# EAGLE design ESP32CAM-Enclosure (EAGLE 9.4.2)
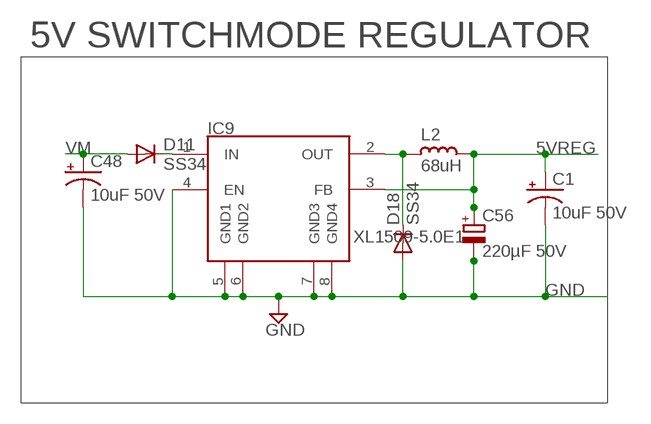
[diagram p0: schematic, sheet 1]

## Parts
C1  10uF 50V  CAP_POL1206  [EIA3216]
C48  10uF 50V  CAP_POL1206  [EIA3216]
C56  220µF 50V  CPOL-EUE3.5-10  [E3,5-10]
D11  SS34  DIODE-DO-214AC  [DO-214AC]
D18  SS34  DIODE-DO-214AC  [DO-214AC]
IC9  XL1509-5.0E1  XL1509  [SO08]
L2  68uH  L_CD75  [CD75]

## Nets
5VREG: C1.A(+) C56.+ IC9.3(FB) L2.1
GND: C1.C(-) C48.C(-) C56.- D18.2(A) IC9.4(EN) IC9.5(GND1) IC9.6(GND2) IC9.7(GND3) IC9.8(GND4)
N$1: D18.1(C) IC9.2(OUT) L2.2
N$26: D11.1(C) IC9.1(IN)
VM: C48.A(+) D11.2(A)

## Notes on the sheet
- 5V SWITCHMODE REGULATOR

## Library data of the parts
C1 C48 = SparkFun:CAP_POL: Capacitor Polarized These are standard SMD and PTH capacitors. Normally 10uF, 47uF, and 100uF in electrolytic and tantalum varieties. Always verify the external diameter of the through hole cap, it varies with capacity, voltage, and manufacturer. The EIA devices should be standard.
C56 = rcl:CPOL-EU: POLARIZED CAPACITOR, European symbol; SPICEPREFIX: C
D11 D18 = dp_devices:DIODE: Various Diode Packages
IC9 = Cohesion_parts:XL1509
L2 = rc-master-smd:L_: INDUCTOR

## Net classes
0 default: width 0.203 mm, clearance 0.152 mm

## Board
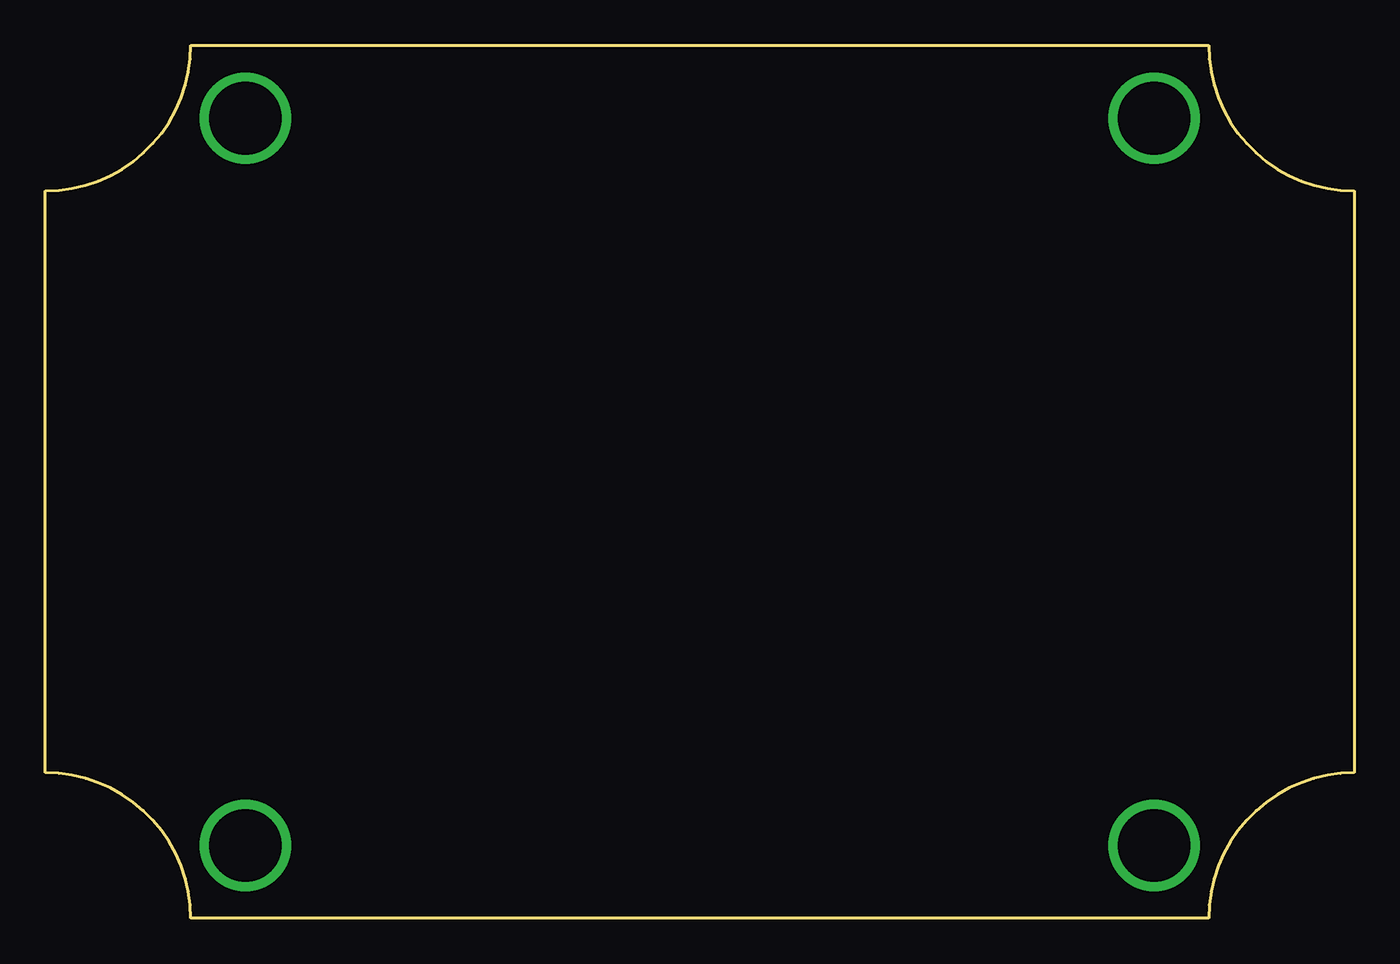
[diagram p1: board, top side]

Size 72 x 48 mm. Coordinates in mm from the lower left corner, seen from the top.
Outline: 0,8 0,40 arc90 8,48 64,48 arc90 72,40 72,8 arc90 64,0 8,0 arc90 0,8
Copper layers (1*16): Top 0.035mm / dielectric 1.5mm / Bottom 0.035mm
Design rules "default": minimum track width 6mil, minimum drill 0.35mm, track to track 6mil, track to pad 6mil, pad to pad 6mil, via to via 6mil, smd to smd 6mil, copper to edge 40mil, drill to drill 6mil, minimum pad ring 10mil, minimum via ring 8mil, stop-mask expansion 4mil, vias tented up to drill 0mil, thermal gap 10mil

### Footprints (pad centres in the part's own frame; a part is rotated, then mirrored left to right if it is on the bottom)
EIA3216 = smd 1.4 x 1.6: A 1.4,0; C -1.4,0
E3,5-10 = drill 0.813 pad 1.6: + -1.778,0 | drill 0.813 pad 1.6 octagon: - 1.778,0
DO-214AC = smd 1.27 x 2.1: 1 -1.98,0; 2 1.98,0
SO08 = smd 0.61 x 2.21: 1 -1.905,-2.616; 2 -0.635,-2.616; 3 0.635,-2.616; 4 1.905,-2.616; 5 1.905,2.616; 6 0.635,2.616; 7 -0.635,2.616; 8 -1.905,2.616
CD75 = smd 7 x 2.85: 1 0,2.54; 2 0,-2.54

### Placement (x,y rotation side)
C1  -8,-44 0 top  (outside the outline)
C48  3.81,-35.56 0 top  (outside the outline)
C56  -6.35,-19.05 0 top  (outside the outline)
D11  -8.89,-38.1 0 top  (outside the outline)
D18  -2.54,-38.1 0 top  (outside the outline)
IC9  2.54,-29.21 0 top  (outside the outline)
L2  -6.35,-29.21 0 top  (outside the outline)

### Tracks (layer width: path | path; a pad name or v marks a point on that pad's centre or on a via)
5VREG  (3 unrouted)
GND  (8 unrouted)
N$1  (2 unrouted)
N$2  (via drill 4)
  other vias: 11,4 61,4 11,44 61,44
N$26  (1 unrouted)
VM  (1 unrouted)